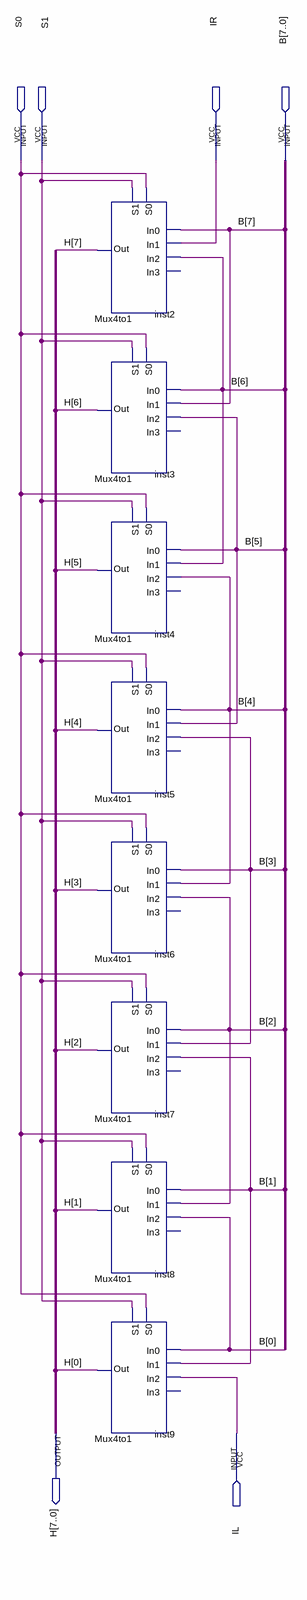
[diagram p0: schematic sheet]
// Quartus schematic Shifter8bit.bdf as structural Verilog: 8 symbols, 6 pins
module Shifter8bit (
  input  S0,
  input  S1,
  input  IR,
  input  [7:0] B,
  input  IL,
  output [7:0] H
);

  Mux4to1 inst2 (.S0(S0), .S1(S1), .In0(B[7]), .In1(IR), .In2(B[6]), .Out(H[7]));  // open: In3
  Mux4to1 inst3 (.S0(S0), .S1(S1), .In0(B[6]), .In1(B[7]), .In2(B[5]), .Out(H[6]));  // open: In3
  Mux4to1 inst4 (.S0(S0), .S1(S1), .In0(B[5]), .In1(B[6]), .In2(B[4]), .Out(H[5]));  // open: In3
  Mux4to1 inst5 (.S0(S0), .S1(S1), .In0(B[4]), .In1(B[5]), .In2(B[3]), .Out(H[4]));  // open: In3
  Mux4to1 inst6 (.S0(S0), .S1(S1), .In0(B[3]), .In1(B[4]), .In2(B[2]), .Out(H[3]));  // open: In3
  Mux4to1 inst7 (.S0(S0), .S1(S1), .In0(B[2]), .In1(B[3]), .In2(B[1]), .Out(H[2]));  // open: In3
  Mux4to1 inst8 (.S0(S0), .S1(S1), .In0(B[1]), .In1(B[2]), .In2(B[0]), .Out(H[1]));  // open: In3
  Mux4to1 inst9 (.S0(S0), .S1(S1), .In0(B[0]), .In1(B[1]), .In2(IL), .Out(H[0]));  // open: In3
endmodule
